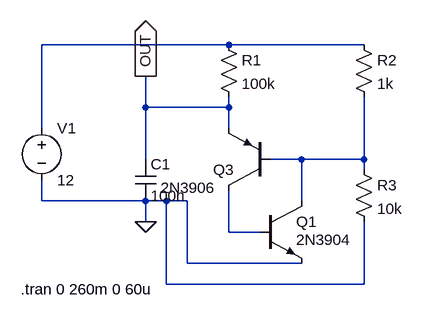
[diagram p0: schematic eca04 exp 5.asc]
eca04 exp 5.asc, the LTspice schematic file:
Version 4.1
SHEET 1 880 680
WIRE 272 0 -16 0
WIRE 480 0 272 0
WIRE 144 96 144 48
WIRE 272 96 272 80
WIRE 272 96 144 96
WIRE -16 128 -16 0
WIRE 272 128 272 96
WIRE 144 176 144 96
WIRE 384 176 336 176
WIRE 480 176 480 80
WIRE 480 176 384 176
WIRE 480 192 480 176
WIRE -16 240 -16 208
WIRE 144 240 -16 240
WIRE 176 240 144 240
WIRE 208 240 176 240
WIRE 384 240 384 176
WIRE 144 272 144 240
WIRE 272 288 272 224
WIRE 320 288 272 288
WIRE 208 336 208 240
WIRE 384 336 208 336
WIRE 176 368 176 240
WIRE 480 368 480 272
WIRE 480 368 176 368
FLAG 144 272 0
FLAG 144 48 OUT
IOPIN 144 48 Out
SYMBOL voltage -16 112 R0
SYMATTR InstName V1
SYMATTR Value 12
SYMBOL res 256 -16 R0
SYMATTR InstName R1
SYMATTR Value 100k
SYMBOL res 464 -16 R0
SYMATTR InstName R2
SYMATTR Value 1k
SYMBOL res 464 176 R0
SYMATTR InstName R3
SYMATTR Value 10k
SYMBOL npn 320 240 R0
WINDOW 3 56 60 Left 2
SYMATTR InstName Q1
SYMATTR Value 2N3904
SYMBOL pnp 336 224 R180
WINDOW 3 84 4 Left 2
SYMATTR InstName Q3
SYMATTR Value 2N3906
SYMBOL cap 128 176 R0
SYMATTR InstName C1
SYMATTR Value 100n
TEXT -48 376 Left 2 !.tran 0 260m 0 60u

The netlist it stands for:
* eca04 exp 5.asc
V1 N001 0 12
R1 N001 OUT 100k
R2 N001 N002 1k
R3 N002 0 10k
Q1 N002 N003 0 0 2N3904
Q3 N003 N002 OUT 0 2N3906
C1 OUT 0 100n
.model NPN NPN
.model PNP PNP
.lib standard.bjt
.tran 0 260m 0 60u
.backanno
.end